# EAGLE design logger3 (EAGLE 6.6.0)
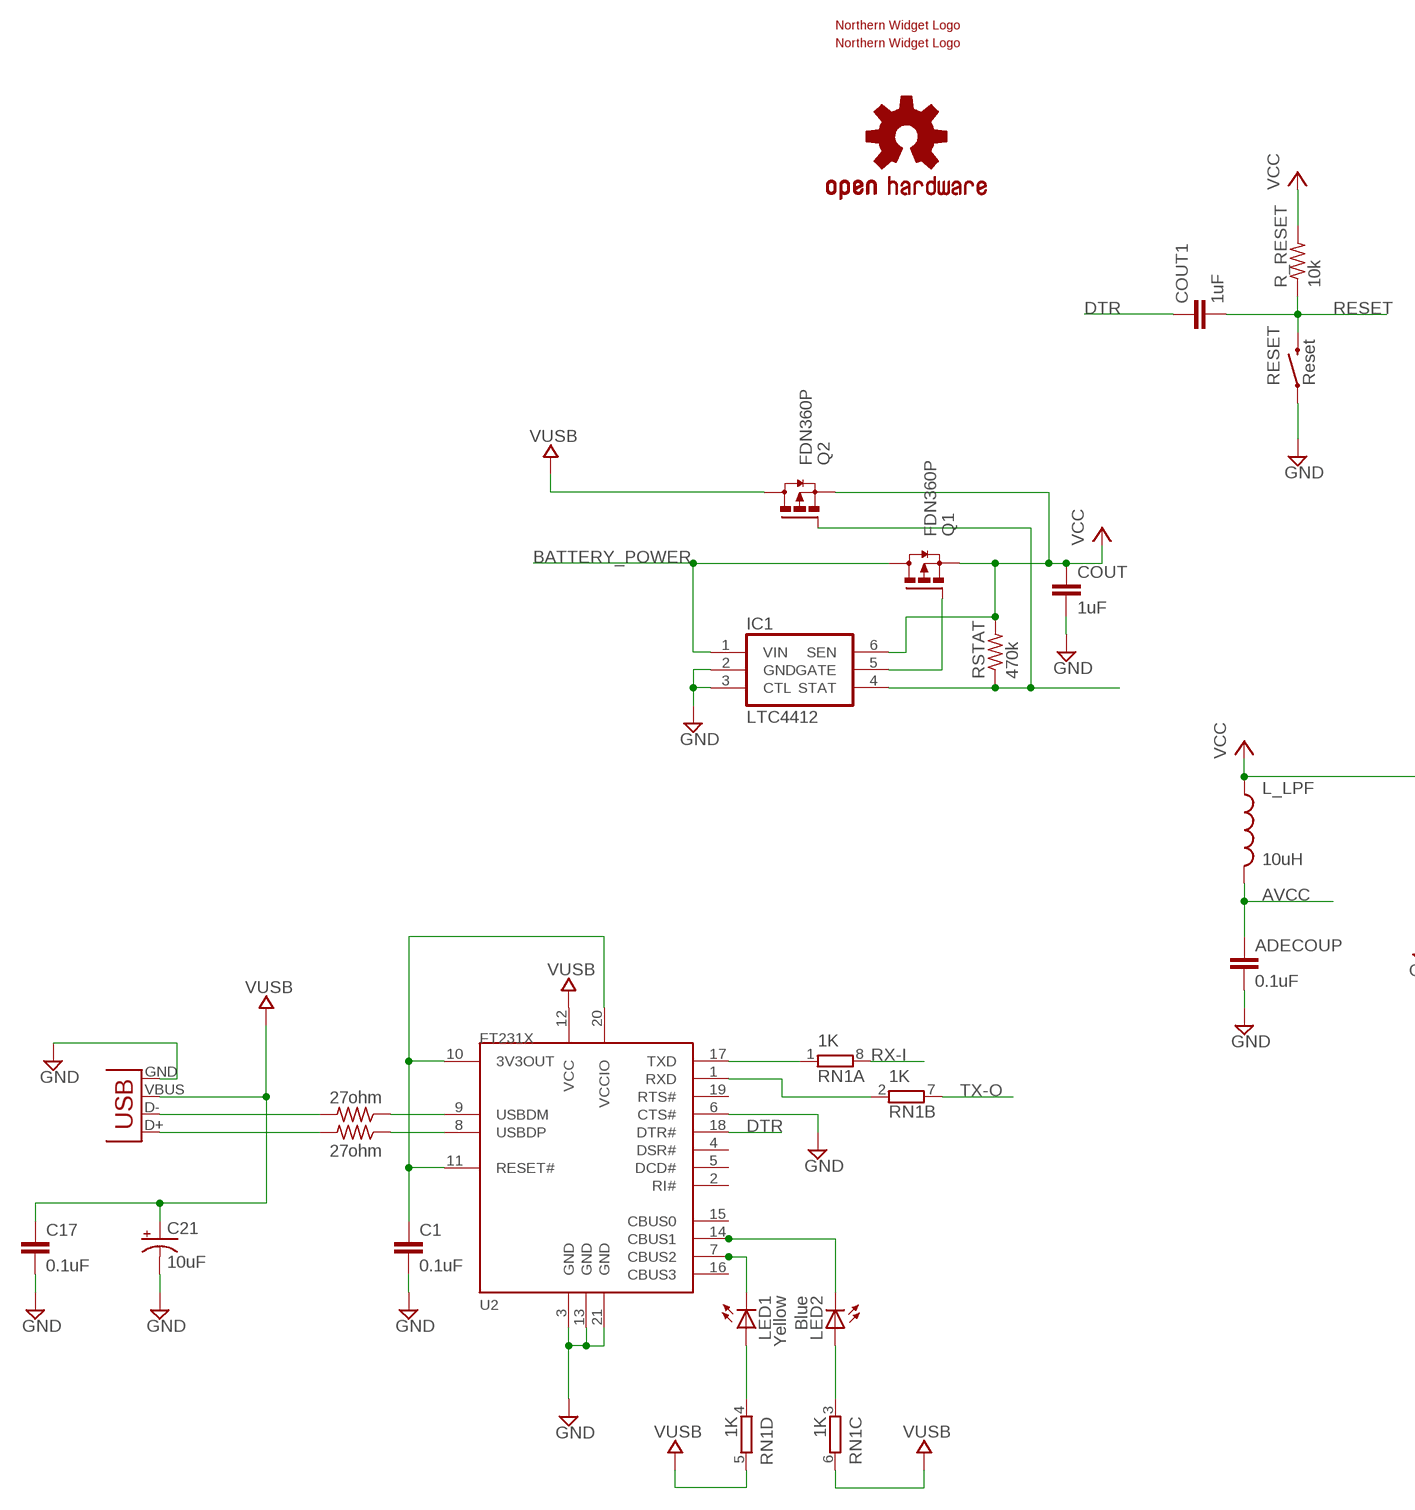
[diagram p0: schematic, sheet 1, part 1 of 2]
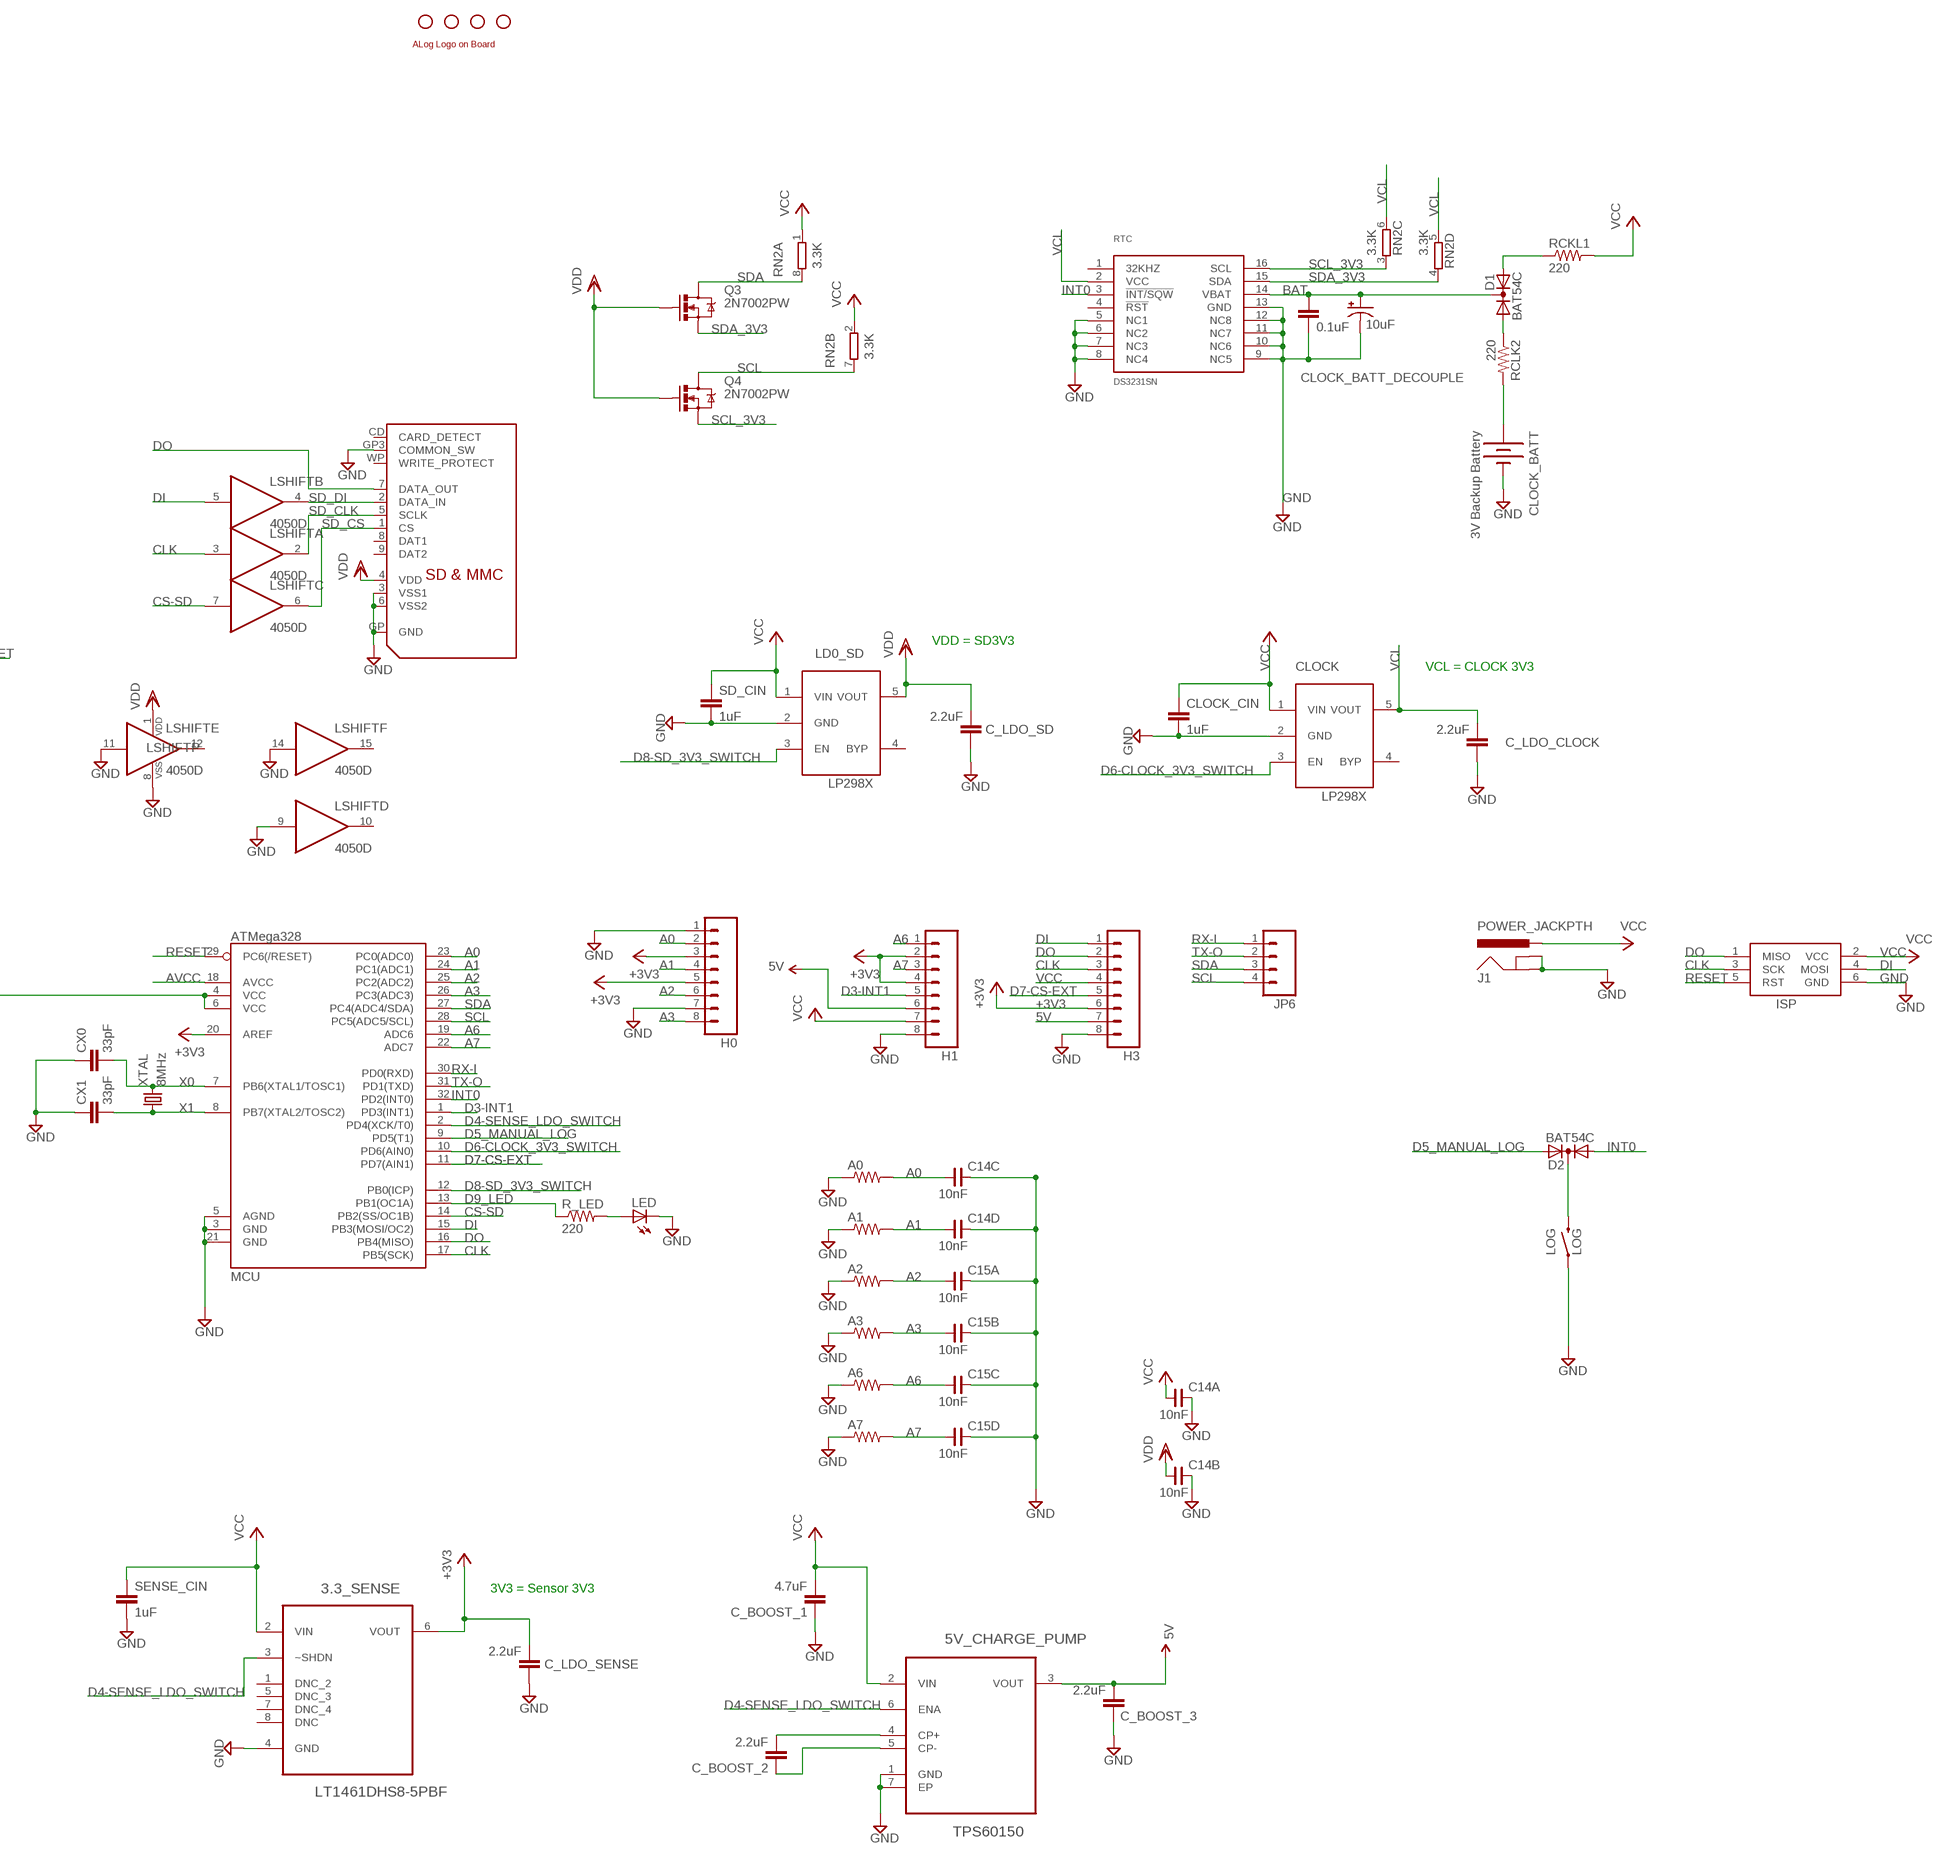
[diagram p1: schematic, sheet 1, part 2 of 2]

## Parts
3.3_SENSE  LT1461DHS8-5PBF  [SOIC127P600X175-8N]
5V_CHARGE_PUMP  TPS60150  TPS60150DRVR  [SON65P200X200X80-7N]
A0  R-US_0207/10  [0207/10]
A1  R-US_0207/10  [0207/10]
A2  R-US_0207/10  [0207/10]
A3  R-US_0207/10  [0207/10]
A6  R-US_0207/10  [0207/10]
A7  R-US_0207/10  [0207/10]
ADECOUP  0.1uF  C-EUC0603  [C0603]
C1  0.1uF  C-EUC0603  [C0603]
C14  10nF  CCA_ECJ-1206  [CECJ-1206]
C15  10nF  CCA_ECJ-1206  [CECJ-1206]
C17  0.1uF  C-EUC0603  [C0603]
C21  10uF  CAP_POL1206  [EIA3216]
C_BOOST_1  4.7uF  C-EUC0603  [C0603]
C_BOOST_2  2.2uF  C-EUC0603  [C0603]
C_BOOST_3  2.2uF  C-EUC0603  [C0603]
C_LDO_CLOCK  2.2uF  C-EUC0603  [C0603]
C_LDO_SD  2.2uF  C-EUC0603  [C0603]
C_LDO_SENSE  2.2uF  C-EUC0603  [C0603]
CLOCK  LP2985  LP298XS  [SOT23-5L]
CLOCK_BATT  3V Backup Battery  BATTERY12PTH  [BATTCON_12MM_PTH]
CLOCK_BATT_DECOUP  0.1uF  C-EUC0603  [C0603]
CLOCK_BATT_DECOUPLE  10uF  CAP_POL1206  [EIA3216]
CLOCK_CIN  1uF  C-EUC0603  [C0603]
COUT  1uF  C-EUC0603  [C0603]
COUT1  1uF  C-EUC0603  [C0603]
CX0  33pF  C-EUC0603  [C0603]
CX1  33pF  C-EUC0603  [C0603]
D1  BAT54C  DIODE_AC-CA_  [SOT23C]
D2  BAT54C  DIODE_AC-CA_  [SOT23C]
D+  27ohm  R-US_R0603  [R0603]
D-  27ohm  R-US_R0603  [R0603]
H0  M083.5MM-8  [SCREWTERMINAL-3.5MM-8]
H1  M083.5MM-8  [SCREWTERMINAL-3.5MM-8]
H3  M083.5MM-8  [SCREWTERMINAL-3.5MM-8]
IC1  LTC4412  LTC4412ES6  [TSOT23-6]
ISP  AVRISP-6  [AVRISP]
J1  POWER_JACKPTH  [POWER_JACK_PTH]
JP1  STAND-OFF  [STAND-OFF]
JP2  STAND-OFF  [STAND-OFF]
JP3  STAND-OFF  [STAND-OFF]
JP4  STAND-OFF  [STAND-OFF]
JP5  USB-B  USBPTH  [USB-B-PTH]
JP6  M04SCREW  [SCREWTERMINAL-3.5MM-4]
L_LPF  10uH  INDUCTOR0805  [0805]
LD0_SD  LP2985  LP298XS  [SOT23-5L]
LED  LED3MM  [LED3MM]
LED1  Yellow  LED0603  [LED-0603]
LED2  Blue  LED0603  [LED-0603]
LOG  LOG  SWITCH-MOMENTARY-2PTH  [TACTILE-PTH]
LOGO1  OSHW-LOGOM  [OSHW-LOGO-M]
LSHIFT  4050D  [SO16]
MCU  ATMega328  ATMEGA168  [TQFP32-08]
Q1  FDN360P  [SUPER-SOT3]
Q2  FDN360P  [SUPER-SOT3]
Q3  2N7002PW  MOSFET-NCHANNELSOT323  [SOT323]
Q4  2N7002PW  MOSFET-NCHANNELSOT323  [SOT323]
R_LED  220  R-US_R0603  [R0603]
R_RESET  10k  R-US_R0603  [R0603]
RCKL1  220  R-US_R0603  [R0603]
RCLK2  220  R-US_R0603  [R0603]
RESET  Reset  SWITCH-MOMENTARY-2PTH  [TACTILE-PTH]
RN1  1K  4R-N0603-ARC  [0603-ARC]
RN2  3.3K  4R-N0603-ARC  [0603-ARC]
RSTAT  470k  R-US_R0603  [R0603]
RTC  DS3231SN  [SO16W]
SD  SDMMC06132  [06132]
SD_CIN  1uF  C-EUC0603  [C0603]
SENSE_CIN  1uF  C-EUC0603  [C0603]
U2  FT231X-Q  [QFN20]
U$1  NWLOGO  [NWLOGO]
U$2  ALOG_LOGO_V1_5.5MM  [ALOG_LOGO_V1_SMALL]
U$3  NWLOGO_MED  [NWLOGO_MED]
XTAL  8MHz  CRYSTALHC49UV  [HC49U-V]

## Nets
5V: 5V_CHARGE_PUMP.3(VOUT) C_BOOST_3.2 H1.6 H3.7
+3V3: 3.3_SENSE.6(VOUT) C_LDO_SENSE.2 H0.3 H0.5 H1.2 H1.4 H3.6 MCU.20(AREF)
A0: A0.2 C14.C1 H0.2 MCU.23(PC0(ADC0))
A1: A1.2 C14.D1 H0.4 MCU.24(PC1(ADC1))
A2: A2.2 C15.A1 H0.6 MCU.25(PC2(ADC2))
A3: A3.2 C15.B1 H0.8 MCU.26(PC3(ADC3))
A6: A6.2 C15.C1 H1.1 MCU.19(ADC6)
A7: A7.2 C15.D1 H1.3 MCU.22(ADC7)
AVCC: ADECOUP.1 L_LPF.2 MCU.18(AVCC)
BAT: CLOCK_BATT_DECOUP.1 CLOCK_BATT_DECOUPLE.A(+) D1.3(K) RTC.14(VBAT)
BATTERY_POWER: IC1.1(VIN) Q1.3(D)
CLK: H3.3 ISP.3(SCK) LSHIFT.3(A:I) MCU.17(PB5(SCK))
CS-SD: LSHIFT.7(C:I) MCU.14(PB2(SS/OC1B))
D3-INT1: H1.5 MCU.1(PD3(INT1))
D4-SENSE_LDO_SWITCH: 3.3_SENSE.3(~SHDN) 5V_CHARGE_PUMP.6(ENA) MCU.2(PD4(XCK/T0))
D5_MANUAL_LOG: D2.2(A2) MCU.9(PD5(T1))
D6-CLOCK_3V3_SWITCH: CLOCK.3(EN) MCU.10(PD6(AIN0))
D7-CS-EXT: H3.5 MCU.11(PD7(AIN1))
D8-SD_3V3_SWITCH: LD0_SD.3(EN) MCU.12(PB0(ICP))
D9_LED: MCU.13(PB1(OC1A)) R_LED.1
DI: H3.1 ISP.4(MOSI) LSHIFT.5(B:I) MCU.15(PB3(MOSI/OC2))
DO: H3.2 ISP.1(MISO) MCU.16(PB4(MISO)) SD.7(DATA_OUT)
DTR: COUT1.1 U2.18(DTR#)
GND: 3.3_SENSE.4(GND) 5V_CHARGE_PUMP.1(GND) 5V_CHARGE_PUMP.7(EP) A0.1 A1.1 A2.1 A3.1 A6.1 A7.1 ADECOUP.2 C1.2 C14.A2 C14.B2 C14.C2 C14.D2 C15.A2 C15.B2 C15.C2 C15.D2 C17.2 C21.C(-) C_BOOST_1.1 C_BOOST_3.1 C_LDO_CLOCK.1 C_LDO_SD.1 C_LDO_SENSE.1 CLOCK.2(GND) CLOCK_BATT.GND(-) CLOCK_BATT_DECOUP.2 CLOCK_BATT_DECOUPLE.C(-) CLOCK_CIN.2 COUT.2 CX0.1 CX1.1 H0.1 H0.7 H1.8 H3.8 IC1.2(GND) IC1.3(CTL) ISP.6(GND) J1.GND J1.GNDBREAK JP5.GND LD0_SD.2(GND) LED.K(C) LOG.1 LSHIFT.8(P:VSS) LSHIFT.9(D:I) LSHIFT.11(E:I) LSHIFT.14(F:I) MCU.3(GND) MCU.5(AGND) MCU.21(GND) RESET.1 RTC.5(NC1) RTC.6(NC2) RTC.7(NC3) RTC.8(NC4) RTC.9(NC5) RTC.10(NC6) RTC.11(NC7) RTC.12(NC8) RTC.13(GND) SD.3(VSS1) SD.6(VSS2) SD.GP3(COMMON_SW) SD.GP(GND) SD_CIN.2 SENSE_CIN.2 U2.3(GND) U2.6(CTS#) U2.13(GND) U2.21(GND)
INT0: D2.1(A1) MCU.32(PD2(INT0)) RTC.3(!INT/SQW)
LED+: LED.A R_LED.2
N$1: D1.1(A1) RCLK2.1
N$2: CLOCK_BATT.VCC@1(+) RCLK2.2
N$3: D+.2 JP5.D+
N$4: D-.2 JP5.D-
N$5: LED1.C U2.7(CBUS2)
N$6: LED2.C U2.14(CBUS1)
N$7: IC1.4(STAT) Q2.1(G) RSTAT.1
N$8: IC1.5(GATE) Q1.1(G)
N$9: LED1.A RN1.4
N$10: LED2.A RN1.3
N$11: D2.3(K) LOG.3
N$13: D-.1 U2.9(USBDM)
N$14: 5V_CHARGE_PUMP.4(CP+) C_BOOST_2.2
N$15: 5V_CHARGE_PUMP.5(CP-) C_BOOST_2.1
N$16: D+.1 U2.8(USBDP)
N$17: C1.1 U2.10(3V3OUT) U2.11(RESET#) U2.20(VCCIO)
N$27: RN1.1 U2.17(TXD)
N$29: RN1.2 U2.1(RXD)
N$67: D1.2(A2) RCKL1.1
RESET: COUT1.2 ISP.5(RST) MCU.29(PC6(/RESET)) R_RESET.1 RESET.3
RX-I: JP6.1 MCU.30(PD0(RXD)) RN1.8
SCL: JP6.4 MCU.28(PC5(ADC5/SCL)) Q4.3(D) RN2.7
SCL_3V3: Q4.2(S) RN2.3 RTC.16(SCL)
SD_CLK: LSHIFT.2(A:O) SD.5(SCLK)
SD_CS: LSHIFT.6(C:O) SD.1(CS)
SD_DI: LSHIFT.4(B:O) SD.2(DATA_IN)
SDA: JP6.3 MCU.27(PC4(ADC4/SDA)) Q3.3(D) RN2.8
SDA_3V3: Q3.2(S) RN2.4 RTC.15(SDA)
TX-O: JP6.2 MCU.31(PD1(TXD)) RN1.7
VCC: 3.3_SENSE.2(VIN) 5V_CHARGE_PUMP.2(VIN) C14.A1 C_BOOST_1.2 CLOCK.1(VIN) CLOCK_CIN.1 COUT.1 H1.7 H3.4 IC1.6(SEN) ISP.2(VCC) J1.PWR L_LPF.1 LD0_SD.1(VIN) MCU.4(VCC) MCU.6(VCC) Q1.2(S) Q2.2(S) R_RESET.2 RCKL1.2 RN2.1 RN2.2 RSTAT.2 SD_CIN.1 SENSE_CIN.1
VCL: C_LDO_CLOCK.2 CLOCK.5(VOUT) RN2.5 RN2.6 RTC.2(VCC)
VDD: C14.B1 C_LDO_SD.2 LD0_SD.5(VOUT) LSHIFT.1(P:VDD) Q3.1(G) Q4.1(G) SD.4(VDD)
VUSB: C17.1 C21.A(+) JP5.VBUS Q2.3(D) RN1.5 RN1.6 U2.12(VCC)
X0: CX0.2 MCU.7(PB6(XTAL1/TOSC1)) XTAL.2
X1: CX1.2 MCU.8(PB7(XTAL2/TOSC2)) XTAL.1
Unconnected: 3.3_SENSE.1(DNC_2) 3.3_SENSE.5(DNC_3) 3.3_SENSE.7(DNC_4) 3.3_SENSE.8(DNC) CLOCK.4(BYP) LD0_SD.4(BYP) LSHIFT.10(D:O) LSHIFT.12(E:O) LSHIFT.15(F:O) RTC.1(32KHZ) RTC.4(!RST) SD.8(DAT1) SD.9(DAT2) SD.CD(CARD_DETECT) SD.WP(WRITE_PROTECT) U2.2(RI#) U2.4(DSR#) U2.5(DCD#) U2.15(CBUS0) U2.16(CBUS3) U2.19(RTS#)

## Notes on the sheet
- VDD = SD3V3
- VCL = CLOCK 3V3
- 3V3 = Sensor 3V3

## Library data of the parts
3.3_SENSE = LTC_By_element14_Batch_1:LT1461DHS8-5PBF: Micropower Precision Low Dropout Series Voltage Reference Family; MPN: LT1461DHS8-5#PBF; OC_FARNELL: 1663431; OC_NEWARK: 57M4326; PACKAGE: SOIC-8; SUPPLIER: Linear Technology
5V_CHARGE_PUMP = ti_by_element14:TPS60150DRVR: Charge Pump Device; MPN: TPS60150DRVR; OC_FARNELL: -; OC_NEWARK: 45P8283; PACKAGE: SON-6; SUPPLIER: Texas Instruments
A0 A1-A3 A6 A7 R_LED = resistor:R-US_: RESISTOR, American symbol
ADECOUP C1 C17 C_BOOST_1-C_BOOST_3 C_LDO_CLOCK C_LDO_SD C_LDO_SENSE CX0 CX1 = resistor:C-EU: CAPACITOR, European symbol
C14 C15 = rc-master-smd:CCA_: CHIP CAP ARRAY
C21 CLOCK_BATT_DECOUPLE = SparkFun-Passives:CAP_POL: Capacitor Polarized These are standard SMD and PTH capacitors. Normally 10uF, 47uF, and 100uF in electrolytic and tantalum varieties. Always verify the external diameter of the through hole cap, it varies with capacity, voltage, and manufacturer. The EIA devices should be standard.
CLOCK LD0_SD = adafruit:LP298X
CLOCK_BATT = SparkFun:BATTERY: Battery Holders Various common sizes : AA, AAA, 20mm coin cell and 12mm coin cell.
CLOCK_BATT_DECOUP CLOCK_CIN COUT COUT1 SD_CIN SENSE_CIN = rcl:C-EU: CAPACITOR, European symbol
D1 D2 = semicon-smd-ipc:DIODE_AC-CA_: DUAL DIODE
D+ D- R_RESET RCKL1 RCLK2 RSTAT = rcl:R-US_: RESISTOR, American symbol
H0 H1 H3 = SparkFun:M08: Header 8 Standard 8-pin 0.1" header. Use with straight break away headers (SKU : PRT-00116), right angle break away headers (PRT-00553), swiss pins (PRT-00743), machine pins (PRT-00117), and female headers (PRT-00115).
IC1 = awickert:LTC4412*: Low Loss PowerPath Controller
ISP = adafruit:AVRISP: AVR ISP HEADER Standard 6 pin header for AVR programming
J1 = SparkFun:POWER_JACK: Power Jack This is the standard 5.5mm barrel jack for power. The PTH is the most common, proven, reliable, footprint. All others are experimental. The Slot footprint only works if the mill layer is transmitted to the PCB fab house so be warned. Spark Fun Electronics SKU : PRT-00119. Mating wall wart : TOL-00298 (and others)
JP1-JP4 = SparkFun:STAND-OFF: Stand Off This is the mechanical footprint for a #4 phillips button head screw. Use the keepout ring to avoid running the screw head into surrounding components. SKU : PRT-00447
JP5 = SparkFun-Connectors:USB: USB Connectors USB-B-PTH is fully proven SKU : PRT-00139/CONN-08278 USB-miniB is fully proven SKU : PRT-00587 USB-A-PCB is untested. USB-A-H is throughly reviewed, but untested. Spark Fun Electronics SKU : PRT-00437 USB-B-SMT is throughly reviewed, but untested. Needs silkscreen touching up. USB-A-S has not been used/tested USB-MB-H has not been used/tested USB-MICROB has been used. CONN-09505; PROD_ID: CONN-08278
JP6 = SparkFun-Connectors:M04: Header 4 Standard 4-pin 0.1" header. Use with straight break away headers (SKU : PRT-00116), right angle break away headers (PRT-00553), swiss pins (PRT-00743), machine pins (PRT-00117), and female headers (PRT-00115). Molex polarized connector foot print use with SKU : PRT-08231 with associated crimp pins and housings. 1MM SMD Version SKU: PRT-10208; PROD_ID: Combine 2x8399
L_LPF = SparkFun:INDUCTOR: Inductors Basic Inductor/Choke - 0603 and 1206. Footprints are not proven and vary greatly between part numbers.
LED = SparkFun:LED: LEDs Standard schematic elements and footprints for 5mm, 3mm, 1206, and 0603 sized LEDs. 5mm - Spark Fun Electronics SKU : COM-00529 (and others)
LED1 LED2 = SparkFun-LED:LED: LEDs Standard schematic elements and footprints for 5mm, 3mm, 1206, and 0603 sized LEDs. 5mm - Spark Fun Electronics SKU : COM-00529 (and others)
LOG RESET = SparkFun-Electromechanical:SWITCH-MOMENTARY-2: Various NO switches- pushbuttons, reed, etc; PROD_ID: SWCH-08441
LOGO1 = SparkFun-Aesthetics:OSHW-LOGO: Open Source Hardware Logo This logo indicates the piece of hardware it is found on incorporates a OSHW license and/or adheres to the definition of open source hardware found here: http://freedomdefined.org/OSHW
LSHIFT = 40xx:4050: Hex non-inverting BUFFER
MCU = SparkFun:ATMEGA168
Q1 Q2 = transistor-power:FDN360P: Single P-Channel, PowerTrench (R) MOSFET Source: http://www.fairchildsemi.com/ds/FD/FDN360P.pdf
Q3 Q4 = SparkFun-DiscreteSemi:MOSFET-NCHANNEL: Generic NMOS footprint
RN1 RN2 = resistor-dil:4R-N: Array Chip Resistor Source: RS Component / Phycomp; OC_FARNELL: unknown; OC_NEWARK: unknown
RTC = comfile:DS3231SN
SD = adafruit:SDMMC: SD MMC Card holder 4UCON part #06132 - easy to solder
U2 = FT231X:FT231X
U$1 = awickert:NWLOGO
U$2 = awickert:ALOG_LOGO_V1_5.5MM
U$3 = awickert:NWLOGO_MED: Medium-sized Northern Widget logo
XTAL = SparkFun:CRYSTAL: Crystals Various standard crystals. Proven footprints. Spark Fun Electronics SKU : COM-00534

## Net classes
0 default: width 0.203 mm, drill 0.305 mm
1 power: width 0.305 mm, drill 0.508 mm
2 gnd: width 0.61 mm, drill 0.508 mm, clearance 0.203 mm
3 usbvcc: width 0.508 mm, drill 0.508 mm, clearance 0.152 mm
4 aref: width 0.406 mm

## Board
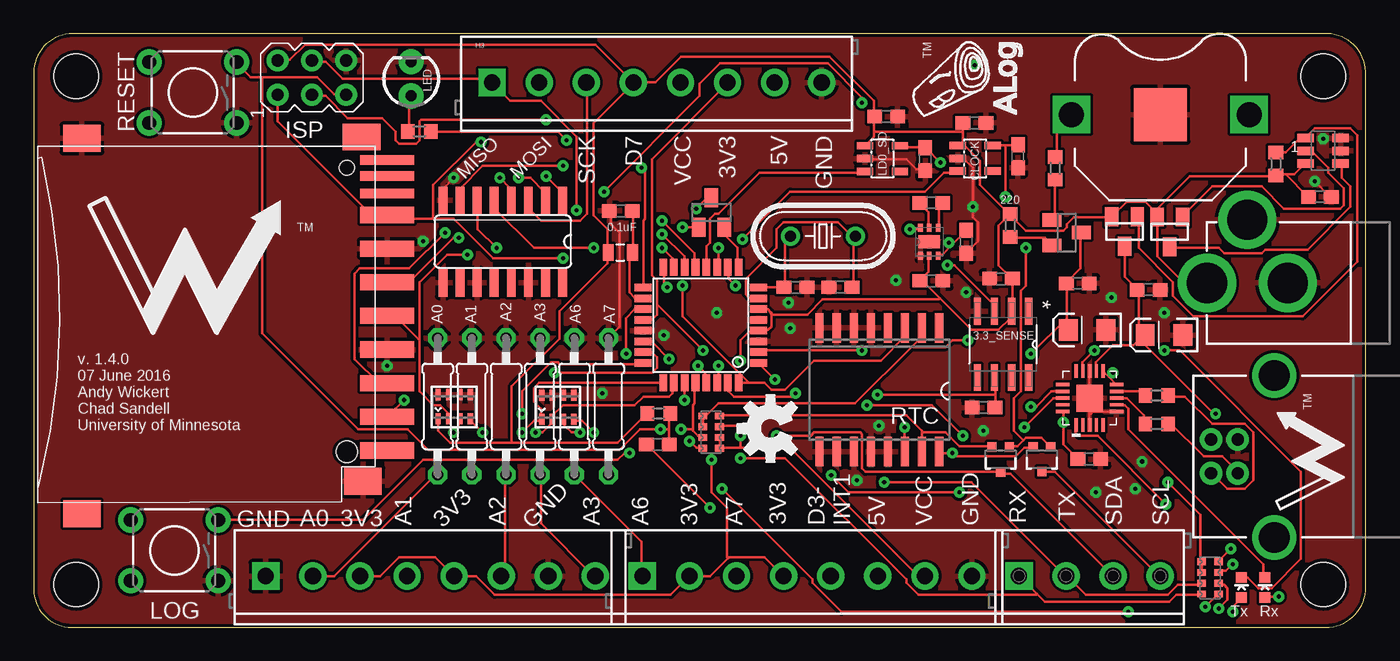
[diagram p2: board, top side]
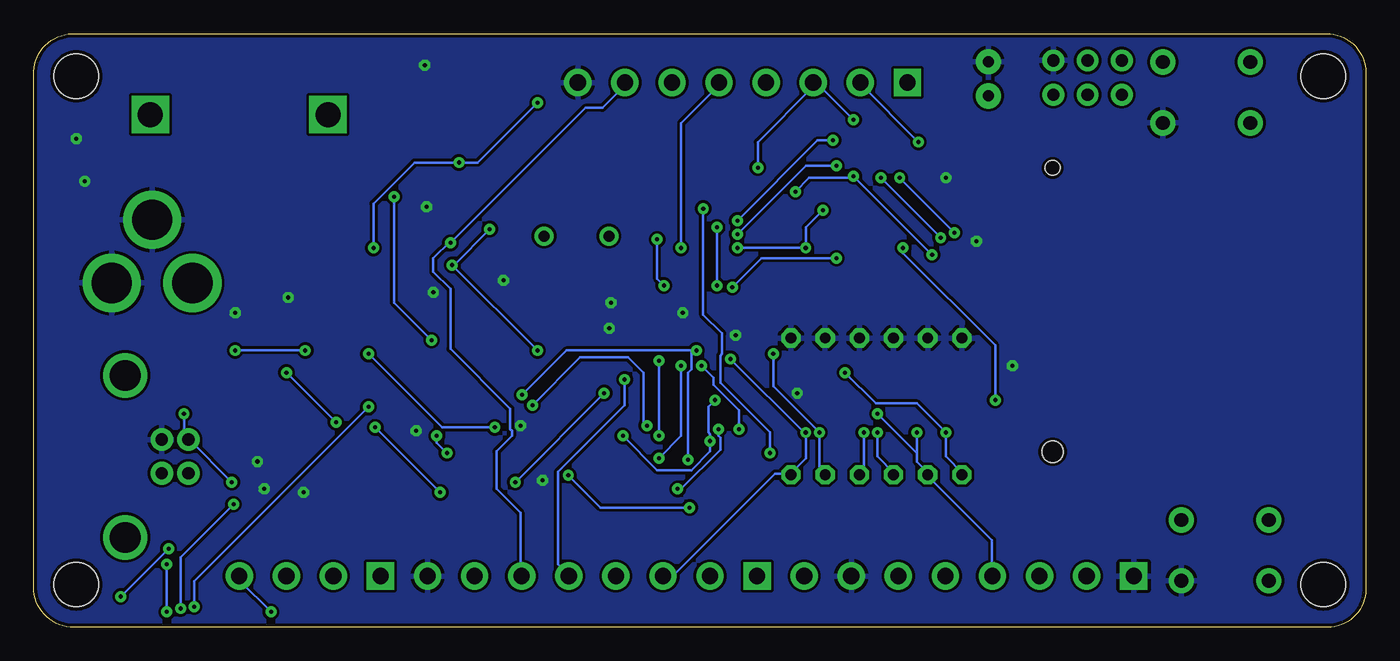
[diagram p3: board, bottom side, seen from below]

Size 99.05 x 44.12 mm. Coordinates in mm from the lower left corner, seen from the top.
Outline: 99.05,41.32 arc90 95.93,44.12 2.91,44.12 arc90 0,41.21 0,2.85 arc90 2.85,0 96.06,0 arc90 99.05,2.98 99.05,41.32
Copper layers (1*16): Top 0.035mm / dielectric 1.5mm / Bottom 0.035mm
Design rules "SparkFun *": minimum track width 8mil, minimum drill 12mil, track to track 8mil, track to pad 8mil, pad to pad 8mil, via to via 8mil, smd to smd 8mil, copper to edge 10mil, drill to drill 8mil, minimum pad ring 12mil, minimum via ring 10mil, stop-mask expansion 4mil, vias tented up to drill 25mil, thermal gap 10mil

### Footprints (pad centres in the part's own frame; a part is rotated, then mirrored left to right if it is on the bottom)
SOIC127P600X175-8N = smd 1.981 x 0.533: 1 -2.464,1.905; 2 -2.464,0.635; 3 -2.464,-0.635; 4 -2.464,-1.905; 5 2.464,-1.905; 6 2.464,-0.635; 7 2.464,0.635; 8 2.464,1.905
SON65P200X200X80-7N = smd 0.61 x 0.356: 1 -1.041,0.66; 2 -1.041,0; 3 -1.041,-0.66; 4 1.041,-0.66; 5 1.041,0; 6 1.041,0.66 | smd 0.991 x 1.6: 7 0,0
0207/10 = drill 0.813 octagon: 1 -5.08,0; 2 5.08,0
C0603 = smd 1.1 x 1: 1 -0.85,0; 2 0.85,0
CECJ-1206 = smd 0.406 x 0.813: A1 -1.2,-0.9; A2 -1.2,0.9; B1 -0.4,-0.9; B2 -0.4,0.9; C1 0.4,-0.9; C2 0.4,0.9; D1 1.2,-0.9; D2 1.2,0.9
EIA3216 = smd 1.4 x 1.6: A 1.4,0; C -1.4,0
SOT23-5L = smd 0.55 x 1.2: 1 -0.95,-1.3; 2 0,-1.3; 3 0.95,-1.3; 4 0.95,1.3; 5 -0.95,1.3
BATTCON_12MM_PTH = smd 3.962 x 3.962: GND 0,0 | drill 1.854 square: VCC@1 -6.604,0; VCC@2 6.604,0
SOT23C = smd 1 x 1.4: 1 -0.95,-1.1; 2 0.95,-1.1; 3 0,1.1
R0603 = smd 1 x 1.1: 1 -0.85,0; 2 0.85,0
SCREWTERMINAL-3.5MM-8 = drill 1.2 pad 2.032 square: 1 0,0 | drill 1.2 pad 2.032: 2 3.5,0; 3 7,0; 4 10.5,0; 5 14,0; 6 17.5,0; 7 21,0; 8 24.5,0
TSOT23-6 = smd 0.622 x 1.22: 1 -0.95,-1.31; 2 0,-1.31; 3 0.95,-1.31; 4 0.95,1.31; 5 0,1.31; 6 -0.95,1.31
AVRISP = drill 0.9 pad 1.626: 1 -1.27,2.54; 2 1.27,2.54; 3 -1.27,0; 4 1.27,0; 5 -1.27,-2.54; 6 1.27,-2.54
POWER_JACK_PTH = drill 2.997 pad 4.318: GND 0,7.7; GNDBREAK 4.7,10.7; PWR 0,13.7
STAND-OFF = hole 3.302: 0,0
USB-B-PTH = drill 0.914 pad 1.676: D+ 0,1.25; D- 1.981,1.25; GND 0,-1.25; VBUS 1.981,-1.25 | drill 2.286: S1 -2.718,-6.02; S2 -2.718,6.02
SCREWTERMINAL-3.5MM-4 = drill 1.2 pad 2.032 square: 1 0,0 | drill 1.2 pad 2.032: 2 3.5,0; 3 7,0; 4 10.5,0
0805 = smd 0.8 x 1.2: 1 -0.9,0; 2 0.9,0
LED3MM = drill 0.813 pad 1.88: A -1.27,0; K 1.27,0
LED-0603 = smd 0.8 x 0.8: A 0,-0.75; C 0,0.75
TACTILE-PTH = drill 1.016 pad 1.88: 1 -3.251,2.261; 2 3.251,2.261; 3 -3.251,-2.261; 4 3.251,-2.261
SO16 = smd 0.66 x 2.032: 1 -4.445,-3.073; 2 -3.175,-3.073; 3 -1.905,-3.073; 4 -0.635,-3.073; 5 0.635,-3.073; 6 1.905,-3.073; 7 3.175,-3.073; 8 4.445,-3.073; 9 4.445,3.073; 10 3.175,3.073; 11 1.905,3.073; 12 0.635,3.073; 13 -0.635,3.073; 14 -1.905,3.073; 15 -3.175,3.073; 16 -4.445,3.073
TQFP32-08 = smd 1.27 x 0.559: 1 -4.293,2.8; 2 -4.293,2; 3 -4.293,1.2; 4 -4.293,0.4; 5 -4.293,-0.4; 6 -4.293,-1.2; 7 -4.293,-2; 8 -4.293,-2.8; 17 4.293,-2.8; 18 4.293,-2; 19 4.293,-1.2; 20 4.293,-0.4; 21 4.293,0.4; 22 4.293,1.2; 23 4.293,2; 24 4.293,2.8 | smd 0.559 x 1.27: 9 -2.8,-4.293; 10 -2,-4.293; 11 -1.2,-4.293; 12 -0.4,-4.293; 13 0.4,-4.293; 14 1.2,-4.293; 15 2,-4.293; 16 2.8,-4.293; 25 2.8,4.293; 26 2,4.293; 27 1.2,4.293; 28 0.4,4.293; 29 -0.4,4.293; 30 -1.2,4.293; 31 -2,4.293; 32 -2.8,4.293
SUPER-SOT3 = smd 1 x 1.4: 1 -0.95,-1.1; 2 0.95,-1.1; 3 0,1.1
SOT323 = smd 0.7 x 0.7: 1 -0.65,-0.925; 2 0.65,-0.925; 3 0,0.925
0603-ARC = smd 0.5 x 0.65: 1 -1.2,-0.625; 2 -0.4,-0.625; 3 0.4,-0.625; 4 1.2,-0.625; 5 1.2,0.625; 6 0.4,0.625; 7 -0.4,0.625; 8 -1.2,0.625
SO16W = smd 0.6 x 2.2: 1 -4.445,-4.6; 2 -3.175,-4.6; 3 -1.905,-4.6; 4 -0.635,-4.6; 5 0.635,-4.6; 6 1.905,-4.6; 7 3.175,-4.6; 8 4.445,-4.6; 9 4.445,4.6; 10 3.175,4.6; 11 1.905,4.6; 12 0.635,4.6; 13 -0.635,4.6; 14 -1.905,4.6; 15 -3.175,4.6; 16 -4.445,4.6
06132 = smd 1.2 x 4: 1 6.9,0.9; 2 4.4,0.9; 3 1.9,0.9; 4 -0.6,0.9; 5 -3.1,0.9; 6 -5.6,0.9; 7 -8.1,0.9; 9 9.4,0.9 | smd 0.7 x 4: 8 -9.7,0.9; CD -11,0.9; WP -12.2,0.9 | smd 2 x 2.8: GP -13.8,-21.8; GP2 14.1,-21.8; GP3 11.7,-0.9; GP4 -13.9,-1 | hole 1.1: -11.6,-2.1 | hole 1.6: 9.5,-2.1
QFN20 = smd 1 x 0.25: 1 -2.032,0.968; 2 -2.032,0.468; 3 -2.032,-0.032; 4 -2.032,-0.532; 5 -2.032,-1.032; 11 1.968,-1.032; 12 1.968,-0.532; 13 1.968,-0.032; 14 1.968,0.468; 15 1.968,0.968 | smd 0.25 x 1: 6 -1.032,-2.032; 7 -0.532,-2.032; 8 -0.032,-2.032; 9 0.468,-2.032; 10 0.968,-2.032; 16 0.968,1.968; 17 0.468,1.968; 18 -0.032,1.968; 19 -0.532,1.968; 20 -1.032,1.968 | smd 2 x 2: 21 -0.032,-0.032
HC49U-V = drill 0.813: 1 -2.413,0; 2 2.413,0

### Placement (x,y rotation side)
3.3_SENSE  72.08,21.03 270 top
5V_CHARGE_PUMP  66.59,28.65 90 top
A0  30.04,16.42 270 top
A1  32.58,16.42 270 top
A2  35.12,16.42 270 top
A3  37.66,16.42 270 top
A6  40.2,16.42 270 top
A7  42.74,16.42 270 top
ADECOUP  43.65,30.95 180 top
C1  78.48,12.5 0 top
C14  31.27,16.39 0 top
C15  38.98,16.36 0 top
C17  82.89,25.08 0 top
C21  84.03,21.72 180 top
C_BOOST_1  66.74,25.76 180 top
C_BOOST_2  66.74,31.55 0 top
C_BOOST_3  69.33,28.65 90 top
C_LDO_CLOCK  73.18,35.01 90 top
C_LDO_SD  66.3,34.8 90 top
C_LDO_SENSE  70.63,16.32 0 top
CLOCK  70.01,34.85 270 top
CLOCK_BATT  83.77,38.1 0 top
CLOCK_BATT_DECOUP  77.63,25.57 0 top
CLOCK_BATT_DECOUPLE  78.32,22.1 180 top
CLOCK_CIN  69.94,37.49 0 top
COUT  95.63,31.99 0 top
COUT1  46.41,13.59 0 top
CX0  59.98,25.27 0 top
CX1  56.64,25.27 180 top
D1  76.81,29.33 270 top
D2  50.4,30.82 0 top
D+  83.51,15.11 0 top
D-  83.51,17.22 0 top
H0  17.26,3.81 0 top
H1  45.26,3.81 0 top
H3  34.09,40.49 0 top
IC1  95.86,35.41 90 top
ISP  20.69,40.86 90 top
J1  100.94,25.59 90 top
JP1  3.17,3.17 0 top
JP2  95.88,40.96 90 top
JP3  95.88,3.17 90 top
JP4  3.17,40.96 0 top
JP5  89.52,12.7 180 top
JP6  73.26,3.81 0 top
L_LPF  43.63,27.85 0 top
LD0_SD  63.11,34.84 270 top
LED  28.07,40.77 90 top
LED1  91.54,2.96 0 top
LED2  89.8,2.96 0 top
LOG  10.47,5.71 180 top
LOGO1  54.79,14.78 90 top
LSHIFT  34.88,28.66 180 top
MCU  49.61,22.45 180 top
Q1  84.47,29.39 180 top
Q2  81.11,29.42 180 top
Q3  71.89,12.48 180 top
Q4  74.96,12.49 180 top
R_LED  28.68,36.86 180 top
R_RESET  46.47,15.89 180 top
RCKL1  72.61,29.87 90 top
RCLK2  75.95,34.11 90 top
RESET  11.84,39.75 180 top
RN1  87.47,3.67 90 top
RN2  50.37,14.5 90 top
RSTAT  92.36,34.43 270 top
RTC  62.88,17.65 180 top
SD  25.39,22.54 270 top
SD_CIN  63.39,37.95 0 top
SENSE_CIN  71.92,25.91 180 top
U2  78.48,17.07 90 top
U$1  11.2,26.47 0 top
U$2  68.29,40.84 90 top
U$3  94.48,12.32 90 top
XTAL  58.69,29.07 0 top

### Tracks (layer width: path | path; a pad name or v marks a point on that pad's centre or on a via)
5V  (via drill 0.3)
  Top 0.203: 68.25,28.38 69.33,29.46 C_BOOST_3.2 | 68.25,28.38 67.55,27.69 67.3,27.69 5V_CHARGE_PUMP.3 | v68.06,28.57 68.25,28.38
  Bottom 0.203: H3.7 54.98,40.39 56.76,38.61 58.03,38.61 v68.06,28.57 68.06,28.7 69.33,27.43 69.33,26.42 68.06,25.15 68.06,20.7 63.62,16.26 63.62,14.73 63.49,14.61 63.49,14.22 64.63,13.08 64.63,10.29 62.86,8.51 62.86,3.81 H1.6
+3V3  (via drill 0.3)
  Top 0.203: H0.3 25.77,3.81 27.17,5.21 29.83,5.21 31.23,3.81 H0.5 32.88,3.81 34.28,2.41 47.36,2.41 H1.2 50.28,3.81 51.62,5.14 | 51.62,5.14 51.68,5.21 54.35,5.21 55.74,3.81 H1.4 | 71.49,17.27 71.49,18.54 3.3_SENSE.6 | 71.49,17.27 71.49,16.38 C_LDO_SENSE.2 | 46.34,24 46.34,25.78 45.96,26.16 45.96,34.8 51.55,40.39 H3.6 | 46.34,24 46.34,23.24 45.96,22.86 MCU.20 | v62.73,17.27 71.49,17.27 | 46.34,24 v49.77,20.57 | v50.41,12.45 50.41,10.03 51.55,8.89 51.55,5.21 51.62,5.14
  Bottom 0.203: v62.73,17.27 59.43,20.57 50.16,20.57 | v50.41,12.45 50.41,18.92 50.16,19.18 50.16,20.57 | 50.16,20.57 v49.77,20.57
A0  (via drill 0.3)
  Top 0.203: v31.23,14.48 31.61,14.86 31.61,15.37 C14.C1 | v38.73,18.92 45.96,18.92 46.34,19.3 46.34,20.07 45.96,20.45 MCU.23 | H0.2 22.34,3.81 29.96,11.43 A0.2
  Bottom 0.203: A0.2 29.96,11.43 31.23,12.7 v31.23,14.48 33.39,16.64 36.44,16.64 v38.73,18.92
A1  (via drill 0.3)
  Top 0.203: v33.39,14.48 32.5,15.37 C14.D1 | v36.31,15.88 36.31,17.53 38.47,19.68 38.98,19.68 39.11,19.56 45.2,19.56 MCU.24
  Bottom 0.203: 33.39,12.95 33.39,12.32 32.5,11.43 A1.2 32.63,11.3 27.8,6.48 27.8,3.81 H0.4 | 33.39,12.95 v33.39,14.48 | 33.39,12.95 v36.31,15.88
A2  (via drill 0.3)
  Top 0.203: MCU.25 37.58,18.16 37.2,17.78 37.2,16.76 37.71,16.26 37.71,15.49 C15.A1 37.71,15.37 37.2,15.37 v36.31,14.48 | A2.2 35.04,11.3 35.04,4.06 34.79,3.81 H0.6
  Bottom 0.203: v36.31,14.48 36.31,12.7 35.04,11.43 A2.2
A3  (via drill 0.3)
  Top 0.203: MCU.26 47.49,18.16 47.49,17.4 47.23,17.14 45.33,17.14 44.69,16.51 39.36,16.51 38.6,15.75 38.6,15.49 C15.B1 38.47,15.37 38.47,15.11 37.84,14.48 v37.33,14.48 | A3.2 37.71,11.3 37.71,7.75 41.65,3.81 H0.8
  Bottom 0.203: v37.33,14.48 37.33,11.68 37.58,11.43 A3.2
A6  (via drill 0.3)
  Top 0.203: v40.63,14.48 40,14.48 39.49,14.99 39.49,15.37 C15.C1 | v44.06,20.32 44.06,22.99 44.69,23.62 45.2,23.62 MCU.19 | H1.1 45.2,3.81 45.2,6.35 40.25,11.3 A6.2
  Bottom 0.203: A6.2 40.12,11.43 40.63,11.94 v40.63,14.48 44.06,17.91 v44.06,20.32
A7  (via drill 0.3)
  Top 0.203: v41.65,14.48 40.76,15.37 40.25,15.37 C15.D1 | v47.23,19.94 45.96,21.21 45.33,21.21 MCU.22
  Bottom 0.203: 41.65,14.35 41.65,12.57 42.79,11.43 | 41.65,14.35 v47.23,19.94 | 41.65,14.35 v41.65,14.48 | H1.3 51.55,3.81 43.93,11.43 42.79,11.43 | 42.79,11.43 A7.2
AVCC
  Top 0.203: ADECOUP.1 44.57,30.86 44.57,27.94 L_LPF.2 44.44,27.81 44.31,27.69 44.31,24.89 44.69,24.51 45.2,24.51 MCU.18
BAT  (via drill 0.3)
  Top 0.203: 76.82,22.99 76.82,22.1 CLOCK_BATT_DECOUPLE.A | 76.82,22.99 76.82,25.53 CLOCK_BATT_DECOUP.1 76.82,25.65 77.84,26.67 77.84,29.21 D1.3 | v64.76,14.86 64.76,13.08 RTC.14 | 76.82,22.99 v74.16,20.32
  Bottom 0.203: v64.76,14.86 68.7,14.86 v74.16,20.32
BATTERY_POWER
  Top 0.203: IC1.1 97.27,34.42 97.27,33.4 97.91,32.77 97.91,31.24 94.73,28.07 91.56,28.07 91.3,27.81 88.51,27.81 88.13,28.19 84.57,28.19 Q1.3
CLK  (via drill 0.3)
  Top 0.203: v45.2,34.16 45.46,33.91 45.46,30.35 45.33,30.23 45.33,25.27 MCU.17 | LSHIFT.3 36.82,31.62 36.82,31.11 37.71,30.23 40.63,30.23 41.14,30.73 41.14,40.39 H3.3 | v38.09,37.72 28.82,37.72 28.69,37.59 28.69,36.2 28.44,35.94 27.17,35.94 26.91,36.2 26.91,36.83 25.9,37.85 23.36,37.85 21.71,39.5 20.69,39.5 ISP.3
  Bottom 0.203: v45.2,34.16 45.2,36.07 41.14,40.13 41.14,40.39 H3.3 41.14,40.01 40.38,40.01 v38.09,37.72
CS-SD  (via drill 0.3)
  Top 0.203: v46.73,29.21 48.38,27.56 48.38,26.8 MCU.14 | v39.36,34.29 33.39,34.29 31.74,32.64 31.74,31.75 LSHIFT.7
  Bottom 0.203: v46.73,29.21 41.65,34.29 v39.36,34.29
D3-INT1  (via drill 0.3)
  Top 0.203: v55.11,18.41 53.97,19.56 MCU.1
  Bottom 0.203: v55.11,18.41 55.11,16.51 60.06,11.56 60.06,4.7 59.17,3.81 H1.5
D4-SENSE_LDO_SWITCH  (via drill 0.3)
  Top 0.203: v65.14,29.59 65.9,29.59 5V_CHARGE_PUMP.6 | v67.93,26.92 68.44,26.92 71.36,24 71.36,23.5 3.3_SENSE.3 | v61.59,20.57 53.97,20.57 MCU.2
  Bottom 0.203: v65.14,29.59 67.81,26.92 v67.93,26.92 v61.59,20.57
D5_MANUAL_LOG
  Top 0.203: MCU.9 52.31,26.8 52.31,28.19 51.43,29.08 51.43,29.72 D2.2
D6-CLOCK_3V3_SWITCH  (via drill 0.3)
  Top 0.203: v52.7,28.83 56.25,32.38 66.28,32.38 67.68,33.78 68.7,33.78 CLOCK.3 | v52.19,25.4 51.68,25.91 51.68,26.67 MCU.10
  Bottom 0.203: v52.7,28.83 52.7,25.91 v52.19,25.4
D7-CS-EXT  (via drill 0.3)
  Top 0.203: v50.92,28.19 50.92,26.8 MCU.11
  Bottom 0.203: v50.92,28.19 50.92,37.47 48,40.39 H3.5
D8-SD_3V3_SWITCH
  Top 0.203: LD0_SD.3 61.71,33.78 53.97,33.78 50.92,30.73 50.66,30.73 50.28,30.35 50.28,28.57 50.03,28.32 50.03,26.8 MCU.12
D9_LED  (via drill 0.3)
  Top 0.203: v39.61,36.2 38.98,36.83 29.58,36.83 R_LED.1 | v46.73,30.23 49.14,27.81 49.14,26.8 MCU.13
  Bottom 0.203: v39.61,36.2 40.76,36.2 v46.73,30.23
DI  (via drill 0.3)
  Top 0.203: v46.73,28.19 47.49,27.43 47.49,26.8 MCU.15 | v41.65,28.19 37.2,28.19 34.28,31.11 34.28,31.62 LSHIFT.5 | v40.38,30.99 40.38,36.45 37.71,39.12 35.42,39.12 34.15,40.39 H3.1 34.03,40.51 33.77,40.77 22.98,40.77 21.71,42.04 20.69,42.04 ISP.4
  Bottom 0.203: v46.73,28.19 v41.65,28.19 41.65,29.72 v40.38,30.99
DO  (via drill 0.3)
  Top 0.203: v47.11,25.27 46.85,25.53 46.85,26.67 MCU.16 | v39.36,27.43 34.15,27.43 31.23,30.35 29.71,30.35 | 29.71,30.35 26.66,30.35 26.41,30.61 SD.7 26.28,30.73 25.01,30.73 18.15,37.59 ISP.1 | v33.26,36.07 32.88,36.07 29.71,32.89 29.71,30.35
  Bottom 0.203: v47.11,25.27 44.95,27.43 v39.36,27.43 | v33.26,36.07 37.58,40.39 H3.2
DTR  (via drill 0.3)
  Top 0.203: v73.65,14.86 75.81,17.02 76.44,17.02 U2.18 | v68.82,10.03 60.57,10.03 v59.3,11.3 | v50.28,8.89 45.58,13.59 COUT1.1
  Bottom 0.203: v68.82,10.03 v73.65,14.86 | v59.3,11.3 56.89,8.89 v50.28,8.89
GND  (via drill 0.3)
  Top 0.203: 78.48,16 78.48,17.02 U2.21 78.48,17.14 78.48,18.92 U2.13 | 78.48,16 78.48,15.11 U2.3 | 78.48,16 80.51,16 U2.6 | CLOCK.2 68.82,34.8 69.2,34.8 69.84,34.16 v69.84,31.24 69.84,30.48 70.22,30.1 70.22,28.7 69.33,27.81 C_BOOST_3.1 | ADECOUP.2 42.92,30.86 42.92,29.97 43.55,29.34 43.55,22.35 42.79,21.59 A7.1 | C_LDO_SD.1 66.28,34.04 65.65,34.04 64.89,34.8 61.84,34.8 LD0_SD.2 | v95.24,33.15 96.38,32 COUT.2 | v31.23,33.4 30.47,32.64 30.47,31.75 LSHIFT.8 | 78.6,15.88 78.69,15.99 | C_LDO_SENSE.1 69.84,16.38 69.73,16.37
  other vias: 46.85,21.72 26.28,19.43 28.95,28.7 69.33,24.89 56.25,22.23 64.12,25.78 56.12,24.13 84.06,23.37 82.41,12.32 81.91,10.29 78.98,10.03 80.13,24.51 61.2,10.92 70.6,14.61 42.28,17.4 95.88,36.32 69.97,41.78 62.86,14.99 50.79,23.37
  pour Bottom: -0.33,44.45 -0.33,-0.32 99.37,-0.32 99.37,44.45
  pour Top: -0.65,44.77 -0.65,-0.64 99.68,-0.64 99.68,44.77
INT0  (via drill 0.3)
  Top 0.203: 53.2,18.16 54.35,18.16 54.85,17.65 55.87,17.65 58.03,19.81 62.98,19.81 64.76,21.59 64.76,22.23 RTC.3 | 53.2,18.16 MCU.32 | v48.25,29.72 49.39,29.72 D2.1 | v48.25,25.4 48.25,23.11 53.2,18.16
  Bottom 0.203: v48.25,25.4 v48.25,29.72
LED+
  Top 0.203: R_LED.2 27.93,36.96 27.93,39.37 28.06,39.5 LED.A
N$1
  Top 0.203: RCLK2.1 75.94,33.15 75.94,30.48 75.81,30.35 D1.1
N$2
  Top 0.203: RCLK2.2 76.06,35.05 76.06,37.08 77.08,38.1 CLOCK_BATT.VCC@1
N$3
  Top 0.203: D+.2 84.44,15.24 86.98,12.7 88.38,12.7 89.52,11.56 JP5.D+
N$4
  Top 0.203: D-.2 84.44,17.14 85.59,17.14 87.62,15.11 90.03,15.11 90.67,14.48 90.67,10.92 90.03,10.29 88.76,10.29 87.62,11.43 JP5.D-
N$5
  Top 0.203: LED1.C 91.43,3.81 91.43,4.7 81.4,14.73 81.4,16.26 81.14,16.51 80.51,16.51 U2.7
N$6  (via drill 0.3)
  Top 0.203: v84.06,20.57 85.21,20.57 94.22,11.56 94.22,5.08 92.06,2.92 91.05,2.92 90.29,3.68 89.91,3.68 LED2.C | v78.86,20.57 77.97,19.68 77.97,19.05 U2.14
  Bottom 0.203: v78.86,20.57 v84.06,20.57
N$7
  Top 0.203: RSTAT.1 92.45,35.31 93.08,35.31 94.1,36.32 94.48,36.32 IC1.4 94.6,36.45 95.24,37.08 97.91,37.08 98.41,36.58 98.41,27.18 94.35,23.11 86.22,23.11 84.7,24.64 84.7,25.65 82.16,28.19 82.16,30.48 Q2.1
N$8
  Top 0.203: IC1.5 94.6,35.31 95.11,35.31 96.26,34.16 96.26,33.78 97.4,32.64 97.4,31.37 97.14,31.11 92.95,31.11 91.3,32.77 87.62,32.77 85.46,30.61 Q1.1
N$9  (via drill 0.3)
  Top 0.203: v89.02,5.84 88.13,4.95 RN1.4 | v92.57,2.29 91.56,2.29 LED1.A
  Bottom 0.203: v92.57,2.29 v89.02,5.84
N$10  (via drill 0.3)
  Top 0.203: v89.14,4.7 88.64,4.19 88.13,4.19 RN1.3 | v89.14,1.14 89.14,1.52 89.78,2.16 LED2.A
  Bottom 0.203: v89.14,1.14 v89.14,4.7
N$11  (via drill 0.3)
  Top 0.203: v49.27,31.11 50.03,31.88 50.28,31.88 D2.3 | v44.31,12.95 43.93,12.95 43.42,12.45 28.95,12.45 24.5,8 13.83,8 LOG.3
  Bottom 0.203: v49.27,31.11 49.27,23.24 47.87,21.84 47.87,20.32 48,20.19 48,18.16 44.31,14.48 v44.31,12.95
N$13
  Top 0.203: U2.9 80.51,17.53 82.29,17.53 82.54,17.27 D-.1
N$14
  Top 0.203: 5V_CHARGE_PUMP.4 67.3,29.72 67.3,31.24 67.55,31.5 C_BOOST_2.2
N$15
  Top 0.203: 5V_CHARGE_PUMP.5 66.54,29.72 66.54,30.86 65.9,31.5 C_BOOST_2.1
N$16
  Top 0.203: U2.8 80.51,17.02 81.27,17.02 82.54,15.75 82.54,15.24 D+.1
N$17  (via drill 0.3)
  Top 0.203: 79.94,18.61 U2.10 | 79.94,18.61 79.62,18.92 U2.11 | U2.20 76.57,16 v76.57,15.24 76.57,13.59 77.59,12.57 C1.1 | v80.25,18.92 79.94,18.61
  Bottom 0.203: v76.57,15.24 v80.25,18.92
N$27  (via drill 0.3)
  Top 0.203: v87.11,1.52 88,2.41 RN1.1 | v74.16,16.38 74.54,16.38 75.68,17.53 76.44,17.53 U2.17
  Bottom 0.203: v87.11,1.52 87.11,3.43 v74.16,16.38
N$29  (via drill 0.3)
  Top 0.203: v88.13,1.4 88.76,2.03 88.76,2.92 88.51,3.17 88.13,3.17 RN1.2 | v84.19,9.14 79.11,14.22 77.71,14.22 77.46,14.48 77.46,14.99 U2.1
  Bottom 0.203: v88.13,1.4 88.13,5.21 v84.19,9.14
N$67
  Top 0.203: RCKL1.1 72.63,28.96 75.17,28.96 75.68,28.45 D1.2
RESET  (via drill 0.3)
  Top 0.203: 47.23,14.73 47.23,15.88 R_RESET.1 | 47.23,14.73 47.23,13.59 COUT1.2 | v49.39,19.43 49.9,18.92 49.9,18.16 MCU.29 | 47.23,14.73 v46.6,14.73 45.08,14.73 43.55,13.21 29.33,13.21 27.8,14.73 24.12,14.73 17.01,21.84 17.01,40.89 | 17.01,40.89 16.12,40.89 15.1,41.91 RESET.3 | 17.01,40.89 21.07,40.89 22.34,39.62 23.23,39.62 ISP.5
  Bottom 0.203: v49.39,19.43 48.5,18.54 48.5,18.03 46.6,16.13 v46.6,14.73
RX-I  (via drill 0.3)
  Top 0.203: 74.6,2.48 JP6.1 | 74.6,2.48 75.17,1.91 84.44,1.91 84.95,2.41 86.73,2.41 RN1.8 | v50.92,19.43 50.92,18.16 MCU.30 | v52.57,12.57 55.87,12.57 64.89,3.56 64.89,3.3 65.78,2.41 74.54,2.41 74.6,2.48
  Bottom 0.203: v50.92,19.43 50.92,14.22 v52.57,12.57
SCL  (via drill 0.3)
  Top 0.203: 49.01,14.73 49.01,16.51 49.14,16.64 49.14,18.16 MCU.28 | 49.01,14.73 49.01,14.61 49.39,14.22 49.65,14.22 RN2.7 | Q4.3 75.05,11.56 75.94,11.56 83.68,3.81 JP6.4 | v48.12,14.73 49.01,14.73 | v51.17,10.29 57.9,3.56 57.9,3.3 60.06,1.14 v81.4,1.14
  Bottom 0.203: v48.12,14.73 48.12,14.22 48,14.1 48,13.21 50.92,10.29 v51.17,10.29 | v81.4,1.14 83.68,3.43 83.68,3.81 JP6.4
SCL_3V3  (via drill 0.3)
  Top 0.203: v53.46,14.99 51.04,14.99 RN2.3 | v61.97,16.51 66.79,16.51 v69.08,14.22 | RTC.16 67.43,12.95 v68.32,12.95 68.57,12.7 73.02,12.7 73.65,13.34 74.28,13.34 Q4.2
  Bottom 0.203: v53.46,14.99 53.71,15.24 53.71,18.92 54.85,20.07 58.41,20.07 v61.97,16.51 | v69.08,14.22 69.08,13.72 v68.32,12.95
SD_CLK  (via drill 0.3)
  Top 0.203: v36.06,33.4 36.95,33.4 37.96,32.38 37.96,31.75 LSHIFT.2 | v31.61,28.96 31.23,28.96 27.93,25.65 26.41,25.65 SD.5
  Bottom 0.203: v31.61,28.96 v36.06,33.4
SD_CS  (via drill 0.3)
  Top 0.203: v34.41,28.19 33.01,29.59 33.01,31.62 LSHIFT.6 | v27.55,16.89 26.41,15.75 SD.1
  Bottom 0.203: v34.41,28.19 34.41,27.81 27.55,20.95 v27.55,16.89
SD_DI  (via drill 0.3)
  Top 0.203: v34.66,33.4 35.42,32.64 35.42,31.75 LSHIFT.4 | v30.6,29.34 27.93,26.67 24.25,26.67 23.87,26.29 23.87,19.94 25.64,18.16 26.28,18.16 SD.2
  Bottom 0.203: v30.6,29.34 v34.66,33.4
SDA  (via drill 0.3)
  Top 0.203: v48.76,13.84 49.27,13.34 49.65,13.34 RN2.8 | v48.38,16.89 48.38,18.16 MCU.27 | JP6.3 72.63,11.43 72,11.43 Q3.3 71.87,11.56 61.84,11.56 61.59,11.81 61.59,14.35 61.46,14.48 58.03,14.48 57.77,14.22 v55.23,14.22
  Bottom 0.203: v48.38,16.89 48.89,16.38 48.89,14.48 48.76,14.35 v48.76,13.84 48.76,13.08 50.16,11.68 52.7,11.68 v55.23,14.22
SDA_3V3
  Top 0.203: 66.03,14.48 66.03,13.08 RTC.15 | 66.03,14.48 66.03,14.61 64.89,15.75 51.04,15.75 RN2.4 | 66.03,14.48 67.81,14.48 68.82,13.46 71.24,13.46 Q3.2
TX-O  (via drill 0.3)
  Top 0.203: RN1.7 86.73,3.17 85.08,3.17 84.32,2.41 78.22,2.41 76.82,3.81 JP6.2 76.7,3.81 69.71,10.79 v63.24,10.79 | v56.63,17.4 56.38,17.14 52.06,17.14 51.68,17.53 51.68,18.16 MCU.31
  Bottom 0.203: v63.24,10.79 v56.63,17.4
VCC  (via drill 0.3)
  Top 0.203: 35.55,13.72 43.42,13.72 45.58,15.88 R_RESET.2 | 35.55,13.72 30.98,13.72 30.09,14.61 30.09,15.37 C14.A1 | 35.55,13.72 35.55,17.91 39.11,21.46 39.11,23.5 42.66,27.05 42.66,27.81 L_LPF.1 42.66,27.94 42.66,29.59 41.65,30.61 41.65,37.47 44.57,40.39 H3.4 | 93.08,33.66 93.72,33.66 94.48,34.42 IC1.6 | 93.08,33.66 92.45,33.66 RSTAT.2 92.32,33.53 85.97,33.53 83.43,30.99 Q1.2 | 93.08,33.66 94.73,32 COUT.1 | Q1.2 83.43,30.61 83.43,30.86 82.67,31.62 81.27,31.62 80.25,30.61 Q2.2 80.13,30.48 77.33,30.48 76.82,29.97 76.82,29.72 76.57,29.46 73.78,29.46 72.63,30.61 RCKL1.2 | Q1.2 83.56,30.48 83.56,27.56 85.46,25.65 87.24,25.65 J1.PWR | 51.04,13.34 51.04,14.1 RN2.2 | 52.57,13.34 56.25,13.34 65.78,3.81 H1.7 | 52.57,13.34 51.04,13.34 | 51.04,13.34 RN2.1 | 69.08,36.83 69.08,36.07 68.82,35.81 CLOCK.1 69.08,35.94 70.35,34.67 70.35,32.89 72.51,30.73 RCKL1.2 | 69.08,36.83 69.08,37.47 CLOCK_CIN.1 | 62.47,36.83 62.47,36.45 61.84,35.81 LD0_SD.1 | 62.47,36.83 62.47,37.85 SD_CIN.1 62.47,37.97 62.47,39.12 59.17,42.42 48.12,42.42 46.22,40.51 44.69,40.51 H3.4 | 62.47,36.83 69.08,36.83 | 54.85,23.24 54.85,23.37 54.79,23.43 | 54.85,23.24 54.85,22.35 54.6,22.1 53.97,22.1 MCU.4 53.84,21.97 53.2,21.97 52.57,21.34 v52.57,19.81 | 54.79,23.43 54.6,23.62 53.97,23.62 MCU.6 | 5V_CHARGE_PUMP.2 66.54,27.56 66.54,26.42 65.9,25.78 C_BOOST_1.2 66.03,25.78 67.36,24.45 | SENSE_CIN.1 72.76,23.5 3.3_SENSE.2 72.63,23.5 72.63,22.99 71.74,22.1 69.71,22.1 67.36,24.45 | SENSE_CIN.1 71.74,26.92 71.74,29.84 72.51,30.61 RCKL1.2 | SENSE_CIN.1 | 54.85,23.24 57.52,23.24 58.66,24.38 67.3,24.38 67.36,24.45 | 54.85,23.24 54.79,23.43
  Top 0.203: v52.57,14.22 52.57,13.34 | ISP.2 18.15,42.16 19.04,42.16 20.18,43.31 41.77,43.31 44.57,40.51 H3.4
  Bottom 0.203: v52.57,19.81 v52.57,14.22
VCL  (via drill 0.3)
  Top 0.203: 72.25,35.81 71.36,35.81 CLOCK.5 | 72.25,35.81 73.14,35.81 C_LDO_CLOCK.2 | RN2.6 49.77,14.99 49.77,15.62 RN2.5 49.77,15.75 50.03,15.75 50.92,16.64 61.08,16.64 65.33,20.89 | 65.33,20.89 66.03,21.59 66.03,22.23 RTC.2 | v72.25,32 72.25,35.81 | v69.46,21.34 68.32,21.34 67.81,20.83 65.39,20.83 65.33,20.89
  Bottom 0.203: v72.25,32 72.25,24.13 v69.46,21.34
VDD  (via drill 0.3)
  Top 0.203: 73.59,13.91 73.78,14.1 74.92,14.1 75.55,13.46 Q4.1 | 73.59,13.91 73.14,13.46 72.63,13.46 Q3.1 | LD0_SD.5 64.51,35.69 66.28,35.69 C_LDO_SD.2 66.41,35.56 v67.43,34.54 | 73.59,13.91 72.89,14.61 72.89,17.02 73.4,17.53 73.4,25.02 73.78,25.4 v73.78,28.19 | 28.63,21.4 26.91,23.11 26.41,23.11 SD.4 | 28.63,21.4 28.69,21.34 28.69,17.53 29.71,16.51 30.22,16.51 30.85,15.88 30.85,15.49 C14.B1 | v38.09,33.53 39.23,32.38 39.23,31.75 LSHIFT.1 | v32.25,27.69 30.72,27.69 28.69,25.65 28.69,21.46 28.63,21.4 | v61.59,38.99 61.59,39.37 59.05,41.91 51.04,41.91 49.52,40.39 49.52,39.5 v42.41,32.38
  Bottom 0.203: v73.78,28.19 73.78,31.5 70.73,34.54 v67.43,34.54 66.03,34.54 v61.59,38.99 | v32.25,27.69 v38.09,33.53 38.09,33.4 41.39,33.4 v42.41,32.38
VUSB  (via drill 0.3)
  Top 0.203: U2.12 78.98,19.05 78.98,19.68 80.25,20.95 81.78,20.95 82.54,21.72 C21.A | C21.A 82.16,21.46 82.16,25.02 C17.1 82.03,25.15 81.14,26.04 81.14,28.19 Q2.3 | RN1.6 86.86,4.19 86.86,4.83 RN1.5 86.73,4.95 86.73,8.38 v84.32,10.79 | v87.87,15.88 87.75,15.88 82.29,21.34 C21.A
  Bottom 0.203: v84.32,10.79 87.49,13.97 JP5.VBUS 87.62,13.97 87.87,14.22 v87.87,15.88
X0
  Top 0.203: CX0.2 60.95,25.27 60.95,28.83 61.08,28.96 XTAL.2 60.95,28.96 59.81,30.1 55.74,30.1 55.23,29.59 55.23,28.19 52.95,25.91 52.95,24.77 53.2,24.51 53.84,24.51 MCU.7
X1
  Top 0.203: MCU.8 53.97,25.27 CX1.2 55.87,25.27 55.87,28.57 56.25,28.96 XTAL.1

### Text on the board
tPlace: TM | MISO | MOSI | SCK | D7 | VCC | 3V3 | 5V | GND | 1 | TM | TM | v. 1.4.0 / 07 June 2016 / Andy Wickert / Chad Sandell / University of Minnesota | GND | A0 | 3V3 | A1 | A2 | A3 | A6 | 3V3 | A7 | 3V3 | D3- / INT1 | 5V | VCC | GND | RX | TX | SDA | SCL | 3V3 | GND | Tx | Rx